# Altium schematic sheet S7CAS-PLEIADES-CARTE-MERE_P02_CLOCKS.SchDoc
size Tabloid; DocumentNumber: 12; SheetNumber: 12; SheetTotal: 14; Size: 11x17; Sheet_Name: Horloge
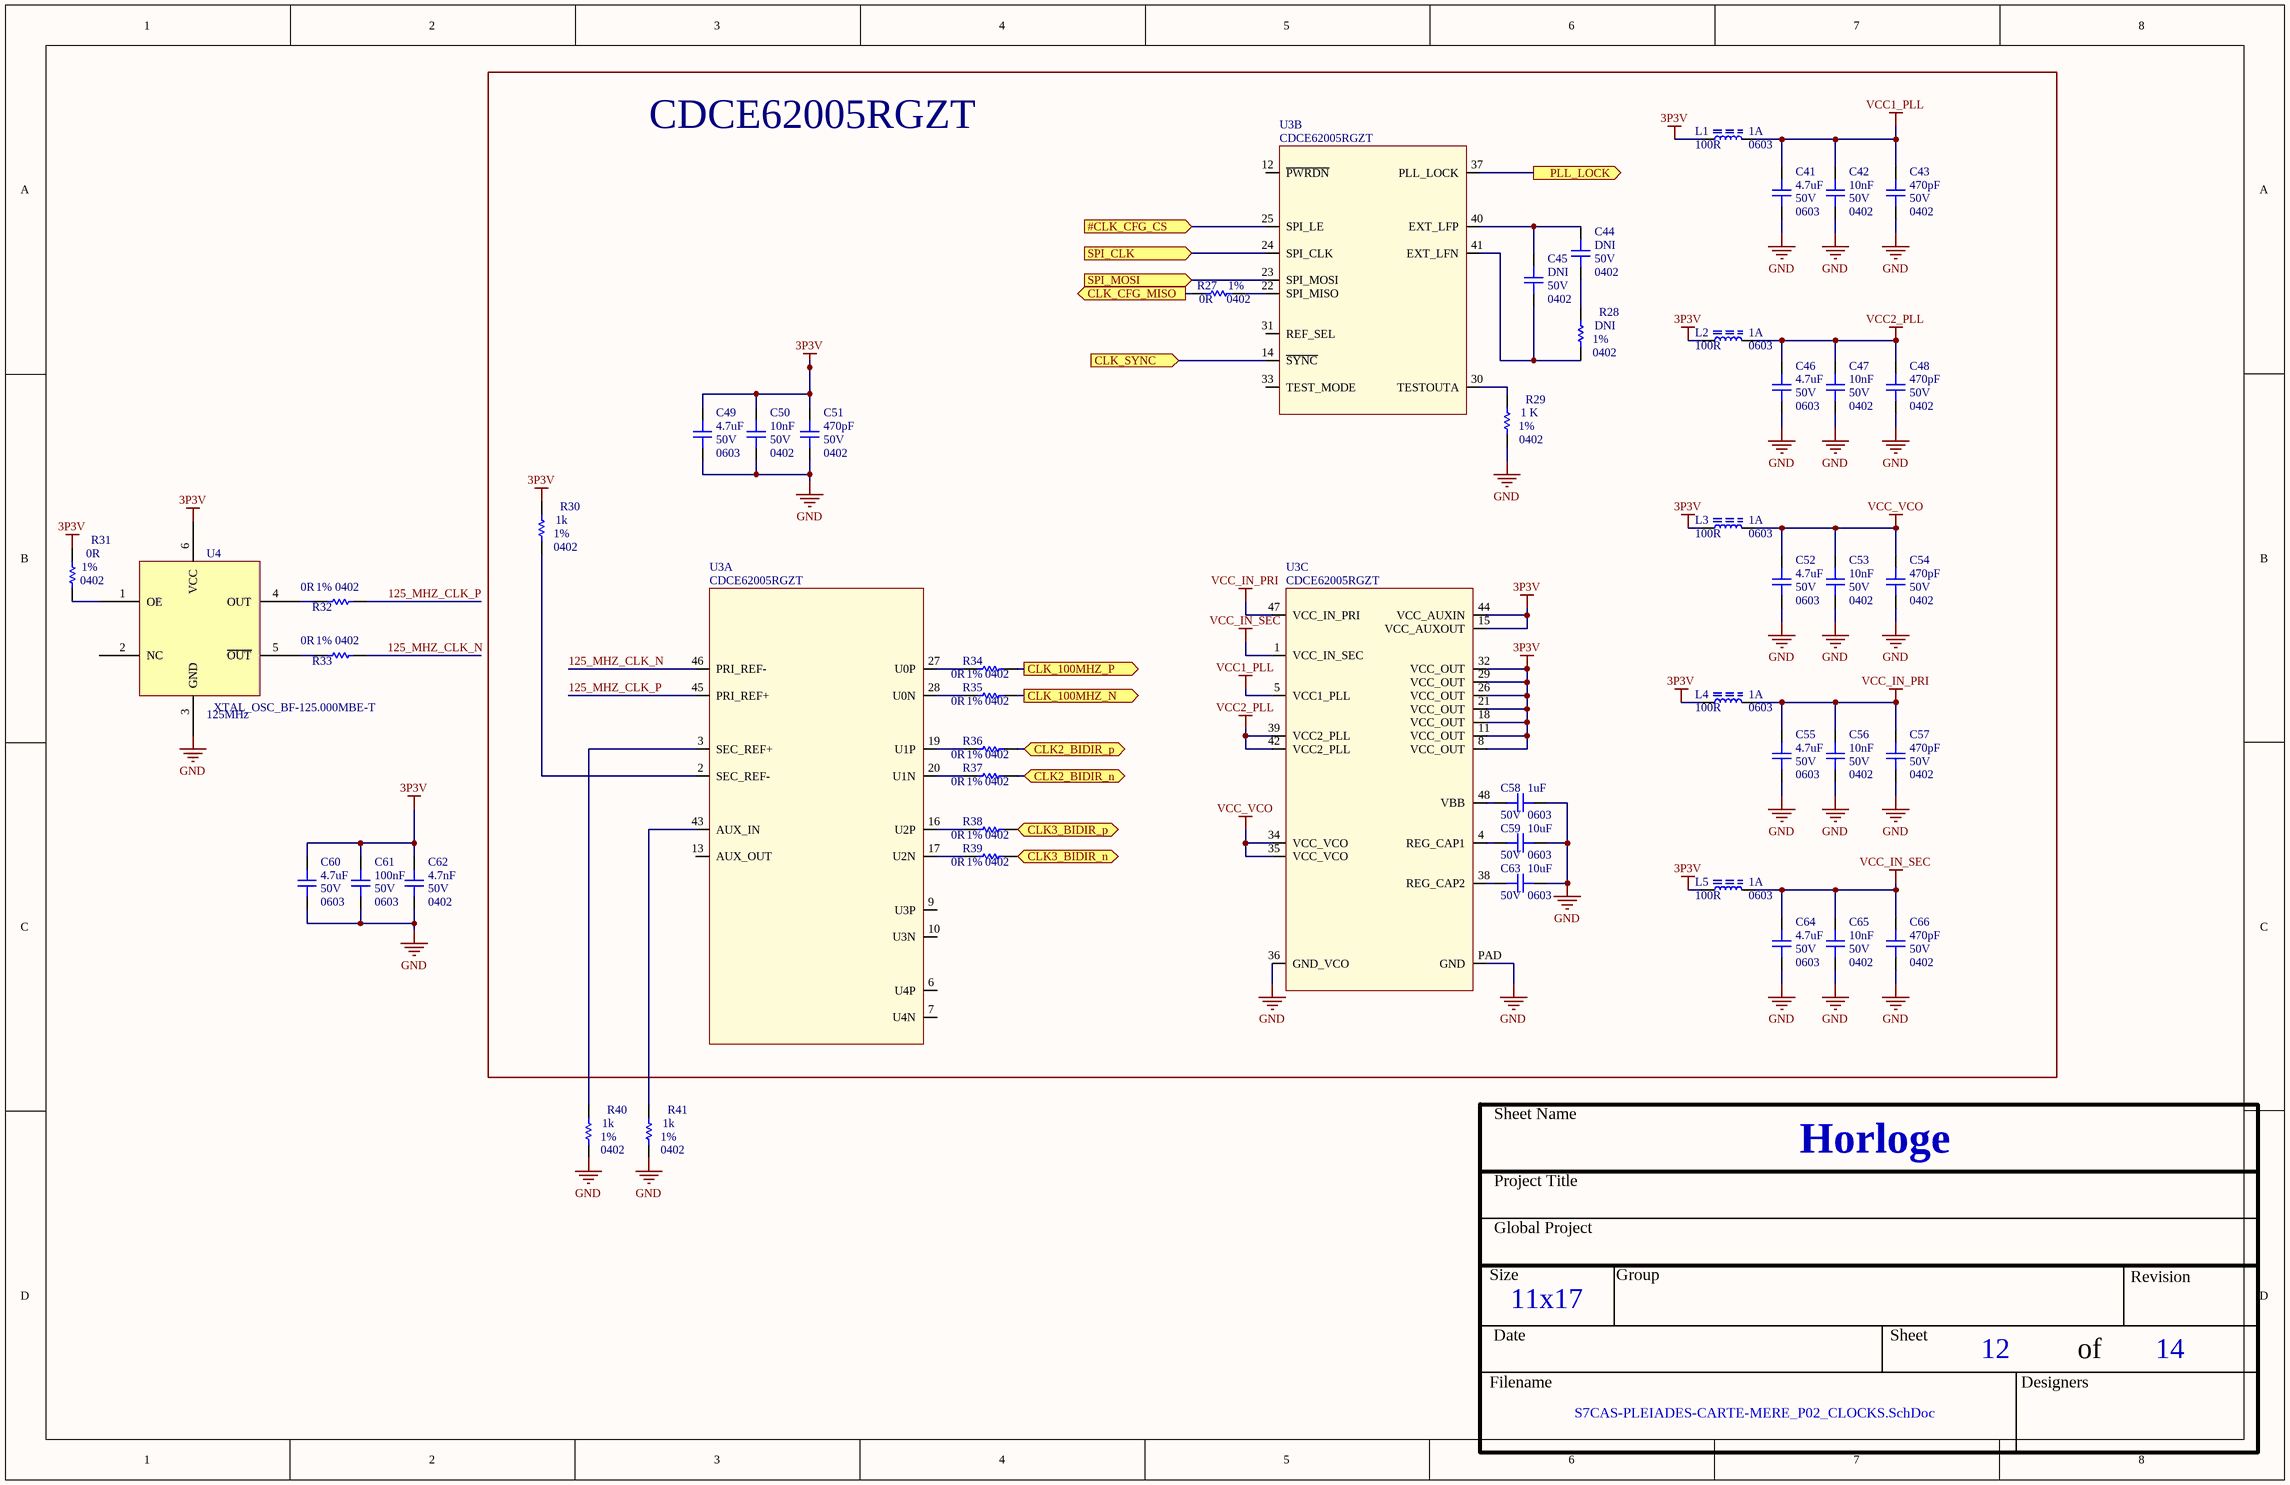
[diagram p0: S7CAS-PLEIADES-CARTE-MERE_P02_CLOCKS.SchDoc]

## Parts
C41  value 4.7uF  Voltage: 50V  Package: 0603  [CAP_0603]  (hidden comment: CAP - 0603)
C42  value 10nF  Voltage: 50V  Package: 0402  [CAP_0402]  (hidden comment: CAP - 0603)
C43  value 470pF  Voltage: 50V  Package: 0402  [CAP_0402]  (hidden comment: CAP - 0603)
C44  value DNI  Voltage: 50V  Package: 0402  [CAP_0402]  (hidden comment: CAP - 0603)
C45  value DNI  Voltage: 50V  Package: 0402  [CAP_0402]  (hidden comment: CAP - 0603)
C46  value 4.7uF  Voltage: 50V  Package: 0603  [CAP_0603]  (hidden comment: CAP - 0603)
C47  value 10nF  Voltage: 50V  Package: 0402  [CAP_0402]  (hidden comment: CAP - 0603)
C48  value 470pF  Voltage: 50V  Package: 0402  [CAP_0402]  (hidden comment: CAP - 0603)
C49  value 4.7uF  Voltage: 50V  Package: 0603  [CAP_0603]  (hidden comment: CAP - 0603)
C50  value 10nF  Voltage: 50V  Package: 0402  [CAP_0402]  (hidden comment: CAP - 0603)
C51  value 470pF  Voltage: 50V  Package: 0402  [CAP_0402]  (hidden comment: CAP - 0603)
C52  value 4.7uF  Voltage: 50V  Package: 0603  [CAP_0603]  (hidden comment: CAP - 0603)
C53  value 10nF  Voltage: 50V  Package: 0402  [CAP_0402]  (hidden comment: CAP - 0603)
C54  value 470pF  Voltage: 50V  Package: 0402  [CAP_0402]  (hidden comment: CAP - 0603)
C55  value 4.7uF  Voltage: 50V  Package: 0603  [CAP_0603]  (hidden comment: CAP - 0603)
C56  value 10nF  Voltage: 50V  Package: 0402  [CAP_0402]  (hidden comment: CAP - 0603)
C57  value 470pF  Voltage: 50V  Package: 0402  [CAP_0402]  (hidden comment: CAP - 0603)
C58  value 1uF  Voltage: 50V  Package: 0603  [CAP_0603]  (hidden comment: CAP - 0603)
C59  value 10uF  Voltage: 50V  Package: 0603  [CAP_0603]  (hidden comment: CAP - 0603)
C60  value 4.7uF  Voltage: 50V  Package: 0603  [CAP_0603]  (hidden comment: CAP - 0603)
C61  value 100nF  Voltage: 50V  Package: 0603  [CAP_0603]  (hidden comment: CAP - 0603)
C62  value 4.7nF  Voltage: 50V  Package: 0402  [CAP_0402]  (hidden comment: CAP - 0603)
C63  value 10uF  Voltage: 50V  Package: 0603  [CAP_0603]  (hidden comment: CAP - 0603)
C64  value 4.7uF  Voltage: 50V  Package: 0603  [CAP_0603]  (hidden comment: CAP - 0603)
C65  value 10nF  Voltage: 50V  Package: 0402  [CAP_0402]  (hidden comment: CAP - 0603)
C66  value 470pF  Voltage: 50V  Package: 0402  [CAP_0402]  (hidden comment: CAP - 0603)
L1  value 100R  Current: 1A  Package: 0603  [FER_0603]  (hidden comment: FER - 0603)
L2  value 100R  Current: 1A  Package: 0603  [FER_0603]  (hidden comment: FER - 0603)
L3  value 100R  Current: 1A  Package: 0603  [FER_0603]  (hidden comment: FER - 0603)
L4  value 100R  Current: 1A  Package: 0603  [FER_0603]  (hidden comment: FER - 0603)
L5  value 100R  Current: 1A  Package: 0603  [FER_0603]  (hidden comment: FER - 0603)
R27  value 0R  Package: 0402  Precision: 1%  [RES_0402]  (hidden comment: RES - 0402)
R28  value DNI  Package: 0402  Precision: 1%  [RES_0402]  (hidden comment: RES - 0402)
R29  value 1 K  Package: 0402  Precision: 1%  [RES_0402]  (hidden comment: RES - 0402)
R30  value 1k  Package: 0402  Precision: 1%  [RES_0402]  (hidden comment: RES - 0402)
R31  value 0R  Package: 0402  Precision: 1%  [RES_0402]  (hidden comment: RES - 0402)
R32  value 0R  Package: 0402  Precision: 1%  [RES_0402]  (hidden comment: RES - 0402)
R33  value 0R  Package: 0402  Precision: 1%  [RES_0402]  (hidden comment: RES - 0402)
R34  value 0R  Package: 0402  Precision: 1%  [RES_0402]  (hidden comment: RES - 0402)
R35  value 0R  Package: 0402  Precision: 1%  [RES_0402]  (hidden comment: RES - 0402)
R36  value 0R  Package: 0402  Precision: 1%  [RES_0402]  (hidden comment: RES - 0402)
R37  value 0R  Package: 0402  Precision: 1%  [RES_0402]  (hidden comment: RES - 0402)
R38  value 0R  Package: 0402  Precision: 1%  [RES_0402]  (hidden comment: RES - 0402)
R39  value 0R  Package: 0402  Precision: 1%  [RES_0402]  (hidden comment: RES - 0402)
R40  value 1k  Package: 0402  Precision: 1%  [RES_0402]  (hidden comment: RES - 0402)
R41  value 1k  Package: 0402  Precision: 1%  [RES_0402]  (hidden comment: RES - 0402)
U3  CDCE62005RGZT  [TIM_CDCE62005RGZT]  (parts A,B,C of 3)
U4  XTAL_OSC_BF-125.000MBE-T  Parameter 1: 125MHz  [BF-125.000MBE-T]

## Blocks framed on the sheet
CDCE62005RGZT: C41-C59 C63-C66 L1-L5 R27-R30 R34-R39 U3

## Ports
#CLK_CFG_CS (in), CLK2_BIDIR_n (bidir), CLK2_BIDIR_p (bidir), CLK3_BIDIR_n (bidir), CLK3_BIDIR_p (bidir), CLK_100MHZ_N (out), CLK_100MHZ_P (out), CLK_CFG_MISO (out), CLK_SYNC (in), PLL_LOCK (out), SPI_CLK (in), SPI_MOSI (in)

## Nets
3P3V: C49.2 C50.2 C51.2 C60.2 C61.2 C62.2 L1.2 L2.2 L3.2 L4.2 L5.2 R30.2 R31.1 U3.8(VCC_OUT) U3.11(VCC_OUT) U3.15(VCC_AUXOUT) U3.18(VCC_OUT) U3.21(VCC_OUT) U3.26(VCC_OUT) U3.29(VCC_OUT) U3.32(VCC_OUT) U3.44(VCC_AUXIN) U4.6(VCC)
GND: C41.1 C42.1 C43.1 C46.1 C47.1 C48.1 C49.1 C50.1 C51.1 C52.1 C53.1 C54.1 C55.1 C56.1 C57.1 C58.1 C59.1 C60.1 C61.1 C62.1 C63.1 C64.1 C65.1 C66.1 R29.1 R40.1 R41.1 U3.36(GND_VCO) U3.PAD(GND) U4.3(GND)
VCC1_PLL: C41.2 C42.2 C43.2 L1.1 U3.5(VCC1_PLL)
VCC2_PLL: C46.2 C47.2 C48.2 L2.1 U3.39(VCC2_PLL) U3.42(VCC2_PLL)
VCC_IN_PRI: C55.2 C56.2 C57.2 L4.1 U3.47(VCC_IN_PRI)
VCC_IN_SEC: C64.2 C65.2 C66.2 L5.1 U3.1(VCC_IN_SEC)
VCC_VCO: C52.2 C53.2 C54.2 L3.1 U3.34(VCC_VCO) U3.35(VCC_VCO)
125_MHZ_CLK_N: R33.1 U3.46(PRI_REF-)
125_MHZ_CLK_P: R32.1 U3.45(PRI_REF+)
#CLK_CFG_CS: U3.25(SPI_LE) ; port #CLK_CFG_CS
CLK2_BIDIR_n: R37.1 ; port CLK2_BIDIR_n
CLK2_BIDIR_p: R36.1 ; port CLK2_BIDIR_p
CLK3_BIDIR_n: R39.1 ; port CLK3_BIDIR_n
CLK3_BIDIR_p: R38.1 ; port CLK3_BIDIR_p
CLK_100MHZ_N: R35.1 ; port CLK_100MHZ_N
CLK_100MHZ_P: R34.1 ; port CLK_100MHZ_P
CLK_CFG_MISO: R27.2 ; port CLK_CFG_MISO
CLK_SYNC: U3.14(~{SYNC}) ; port CLK_SYNC
PLL_LOCK: U3.37(PLL_LOCK) ; port PLL_LOCK
SPI_CLK: U3.24(SPI_CLK) ; port SPI_CLK
SPI_MOSI: U3.23(SPI_MOSI) ; port SPI_MOSI
NetC44_1: C44.1 R28.2
NetC44_2: C44.2 C45.2 U3.40(EXT_LFP)
NetC45_1: C45.1 R28.1 U3.41(EXT_LFN)
NetC58_2: C58.2 U3.48(VBB)
NetC59_2: C59.2 U3.4(REG_CAP1)
NetC63_2: C63.2 U3.38(REG_CAP2)
NetR27_1: R27.1 U3.22(SPI_MISO)
NetR29_2: R29.2 U3.30(TESTOUTA)
NetR30_1: R30.1 U3.2(SEC_REF-)
NetR31_2: R31.2 U4.1(OE)
NetR32_2: R32.2 U4.4(OUT)
NetR33_2: R33.2 U4.5(~{OUT})
NetR34_2: R34.2 U3.27(U0P)
NetR35_2: R35.2 U3.28(U0N)
NetR36_2: R36.2 U3.19(U1P)
NetR37_2: R37.2 U3.20(U1N)
NetR38_2: R38.2 U3.16(U2P)
NetR39_2: R39.2 U3.17(U2N)
NetR40_2: R40.2 U3.3(SEC_REF+)
NetR41_2: R41.2 U3.43(AUX_IN)

Not connected (* = marked no-connect by the designer): U3 6(U4P) 7(U4N) 9(U3P) 10(U3N) 12(~{PWRDN}) 13(AUX_OUT) 31(REF_SEL) 33(TEST_MODE); U4 2(NC)

## Notes on the sheet
- Sheet Name
- Project Title
- Global Project
- Size
- Group
- Revision
- Date
- Sheet
- of
- Filename
- Designers

## Library data of the parts
C41-C66 = CAP - 0603: Precision: 10%; Current: *; CreatedBy: Jonathan Bouchard; Power: *
R27-R41 = RES - 0402: Voltage: 50V; Power: 1/16W; Current: *; CreatedBy: Jonathan Bouchard
U3 = TIM_CDCE62005RGZT: TIM - CLK SYNTH JITTER CLEANER 3:5 - QFN-48; Voltage: 3 V ~ 3.6 V; Mfg: Texas Instruments; Current: *; Power: *; Mfg Part Number: CDCE62005RGZT; HelpURL: http://www.ti.com/lit/ds/symlink/cdce62005.pdf; CreatedBy: Jonathan Bouchard; Temperature: -40°C ~ 85°C; Value: *; Precision: *; Package: QFN-48; Supplier 1: Digikey; Supplier Part Number 1: 296-23947-1-ND
L1-L5 = FER - 0603: Voltage: *; CreatedBy: Jonathan Bouchard; Power: *; Precision: *